# EAGLE design beacon (EAGLE 8.1.1)
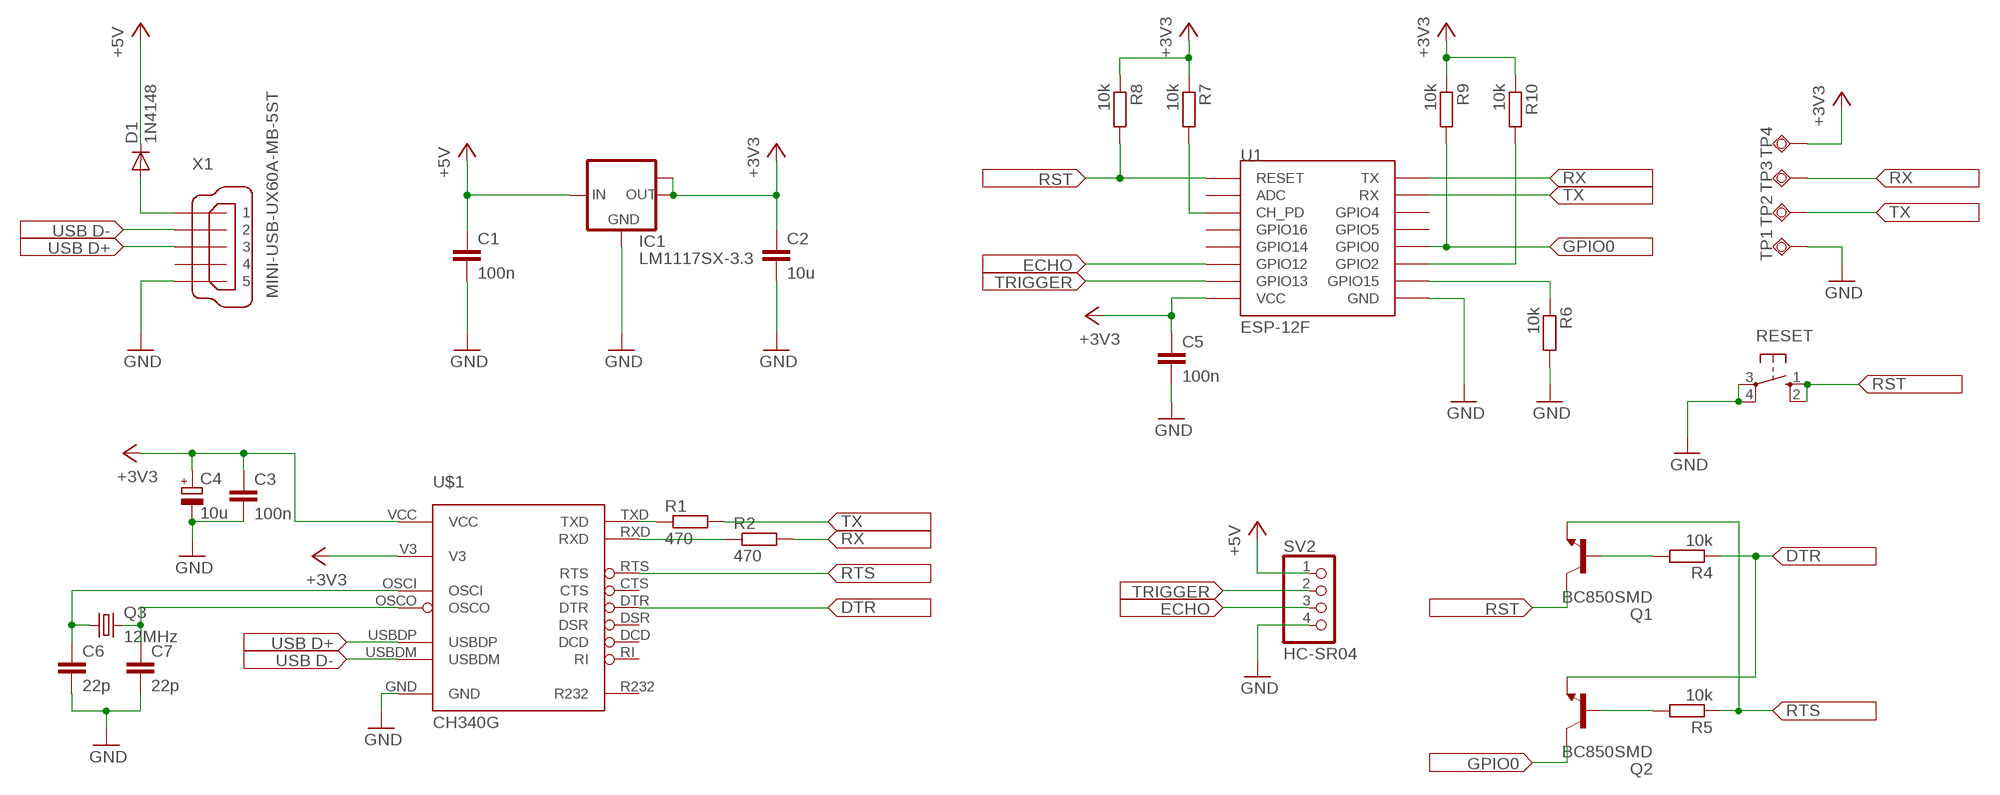
[diagram p0: schematic, sheet 1]

## Parts
C1  100n  C-EUC1206K  [C1206K]
C2  10u  C-EUC1206K  [C1206K]
C3  100n  C-EUC1206K  [C1206K]
C4  10u  CPOL-EU175TMP-0810  [175TMP-0810]
C5  100n  C-EUC1206K  [C1206K]
C6  22p  C-EUC1206K  [C1206K]
C7  22p  C-EUC1206K  [C1206K]
D1  1N4148  S1M  [SMA]
IC1  LM1117SX-3.3  [TO263]
Q1  BC850SMD  [SOT23-BEC]
Q2  BC850SMD  [SOT23-BEC]
Q3  12MHz  CRYSTALSM49  [SM49]
R1  470  R-EU_R1206  [R1206]
R2  470  R-EU_R1206  [R1206]
R4  10k  R-EU_R1206  [R1206]
R5  10k  R-EU_R1206  [R1206]
R6  10k  R-EU_R1206  [R1206]
R7  10k  R-EU_R1206  [R1206]
R8  10k  R-EU_R1206  [R1206]
R9  10k  R-EU_R1206  [R1206]
R10  10k  R-EU_R1206  [R1206]
RESET  10-XX  [B3F-10XX]
SV2  HC-SR04  PINHD-1X4/90  [1X04/90]
TP1  TPSQTP20SQ  [TP20SQ]
TP2  TPSQTP20SQ  [TP20SQ]
TP3  TPSQTP20SQ  [TP20SQ]
TP4  TPSQTP20SQ  [TP20SQ]
U1  ESP-12F  ESP12SMD  [ESP12-SMD]
U$1  CH340G  [SOP16]
X1  MINI-USB-UX60A-MB-5ST  [UX60A-MB-5ST]

## Nets
+3V3: C2.1 C3.1 C4.+ C5.1 IC1.2(OUT) IC1.TAB(OUT1) R7.1 R8.1 R9.1 R10.1 TP4.TP U1.VCC U$1.V3 U$1.VCC
+5V: C1.1 D1.C IC1.3(IN) SV2.1
DTR: Q2.E R4.1 U$1.DTR
ECHO: SV2.3 U1.GPIO12
GND: C1.2 C2.2 C3.2 C4.- C5.2 C6.2 C7.2 IC1.1(GND) R6.2 RESET.3(P) RESET.4(P1) SV2.4 TP1.TP U1.GND U$1.GND X1.5
GPIO0: Q2.C R9.2 U1.GPIO0
N$1: R1.1 U$1.TXD
N$2: R2.1 U$1.RXD
N$3: C6.1 Q3.1 U$1.OSCI
N$4: C7.1 Q3.2 U$1.OSCO
N$5: D1.A X1.1
N$6: R6.1 U1.GPIO15
N$8: R7.2 U1.CH_PD
N$9: Q1.B R4.2
N$11: Q2.B R5.2
N$12: R10.2 U1.GPIO2
RST: Q1.C R8.2 RESET.1(S) RESET.2(S1) U1.RESET
RTS: Q1.E R5.1 U$1.RTS
RX: R2.2 TP3.TP U1.TXD0(TX)
TRIGGER: SV2.2 U1.GPIO13
TX: R1.2 TP2.TP U1.RXD0(RX)
USBDM: U$1.USBDM X1.2
USBDP: U$1.USBDP X1.3
Unconnected: U1.ADC U1.GPIO4 U1.GPIO5 U1.GPIO14 U1.GPIO16 U$1.CTS U$1.DCD U$1.DSR U$1.R232 U$1.RI X1.4

## Library data of the parts
C1-C3 C5-C7 = rcl:C-EU: CAPACITOR, European symbol
C4 = rcl:CPOL-EU: POLARIZED CAPACITOR, European symbol
D1 = diode:S1M
IC1 = lm1117:LM1117SX-*
Q1 Q2 = transistor-npn:BC850*: NPN Transistor
Q3 = crystal:CRYSTAL: CRYSTAL; OC_FARNELL: unknown; OC_NEWARK: unknown
R1 R2 R4-R10 = rcl:R-EU_: RESISTOR, European symbol
RESET = switch-omron:10-XX: OMRON SWITCH; MPN: B3F-1000; OC_FARNELL: 176432; OC_NEWARK: 36M3542
SV2 = pinhead:PINHD-1X4: PIN HEADER
TP1-TP4 = testpad:TPSQ: Test pad
U1 = esp8266modules:ESP12: ESP8266 Wifi module 12
U$1 = ch340g:CH340G
X1 = con-hirose:MINI-USB-: MINI USB Connector Source: http://www.hirose.co.jp/cataloge_hp/e24000019.pdf; OC_FARNELL: unknown; OC_NEWARK: unknown

## Board
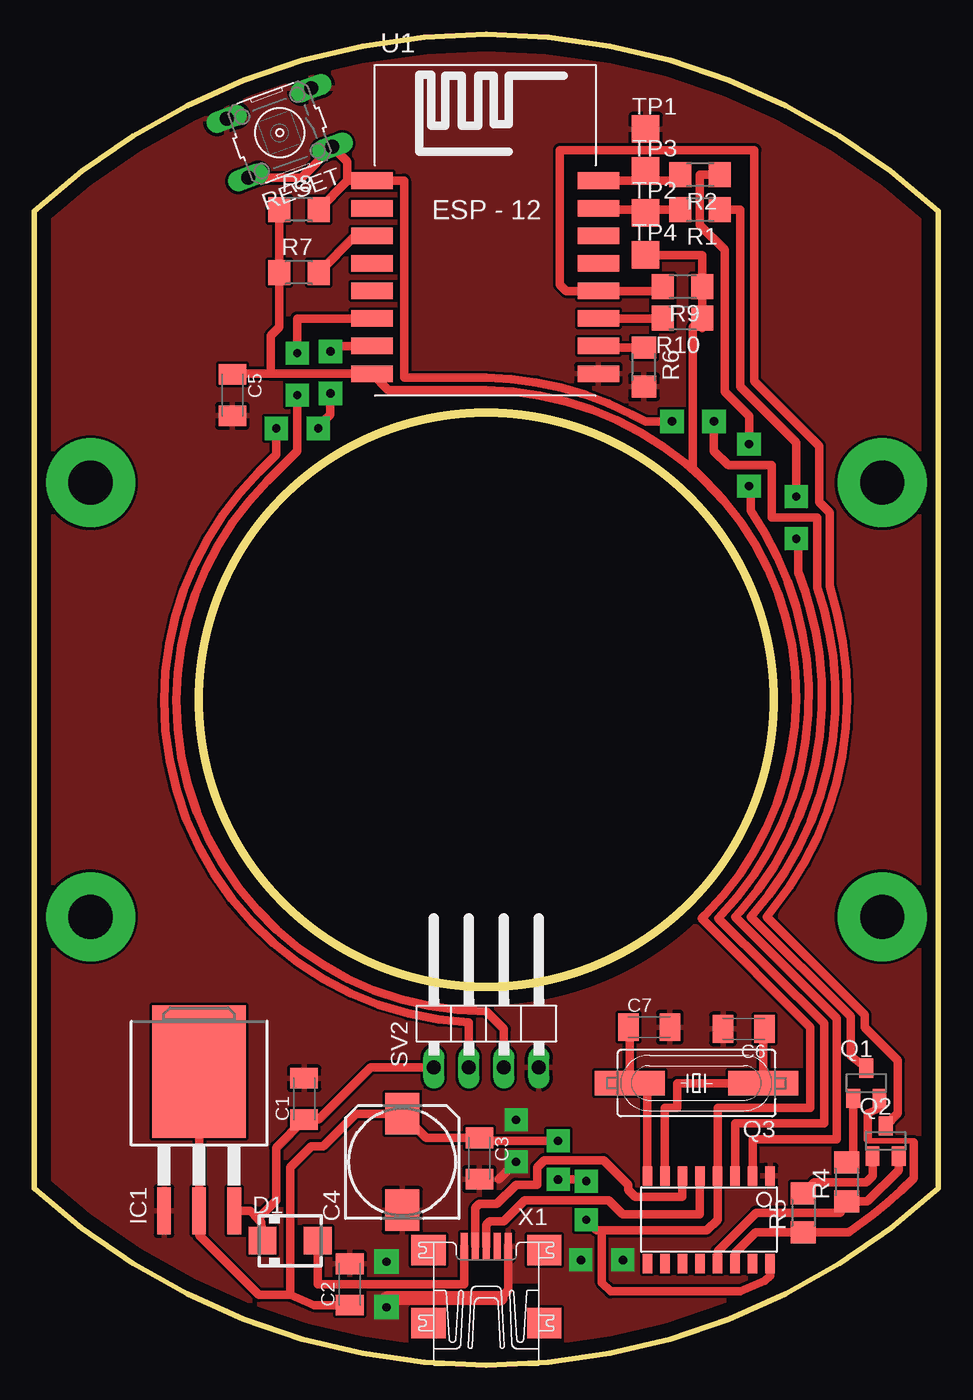
[diagram p1: board, top side]
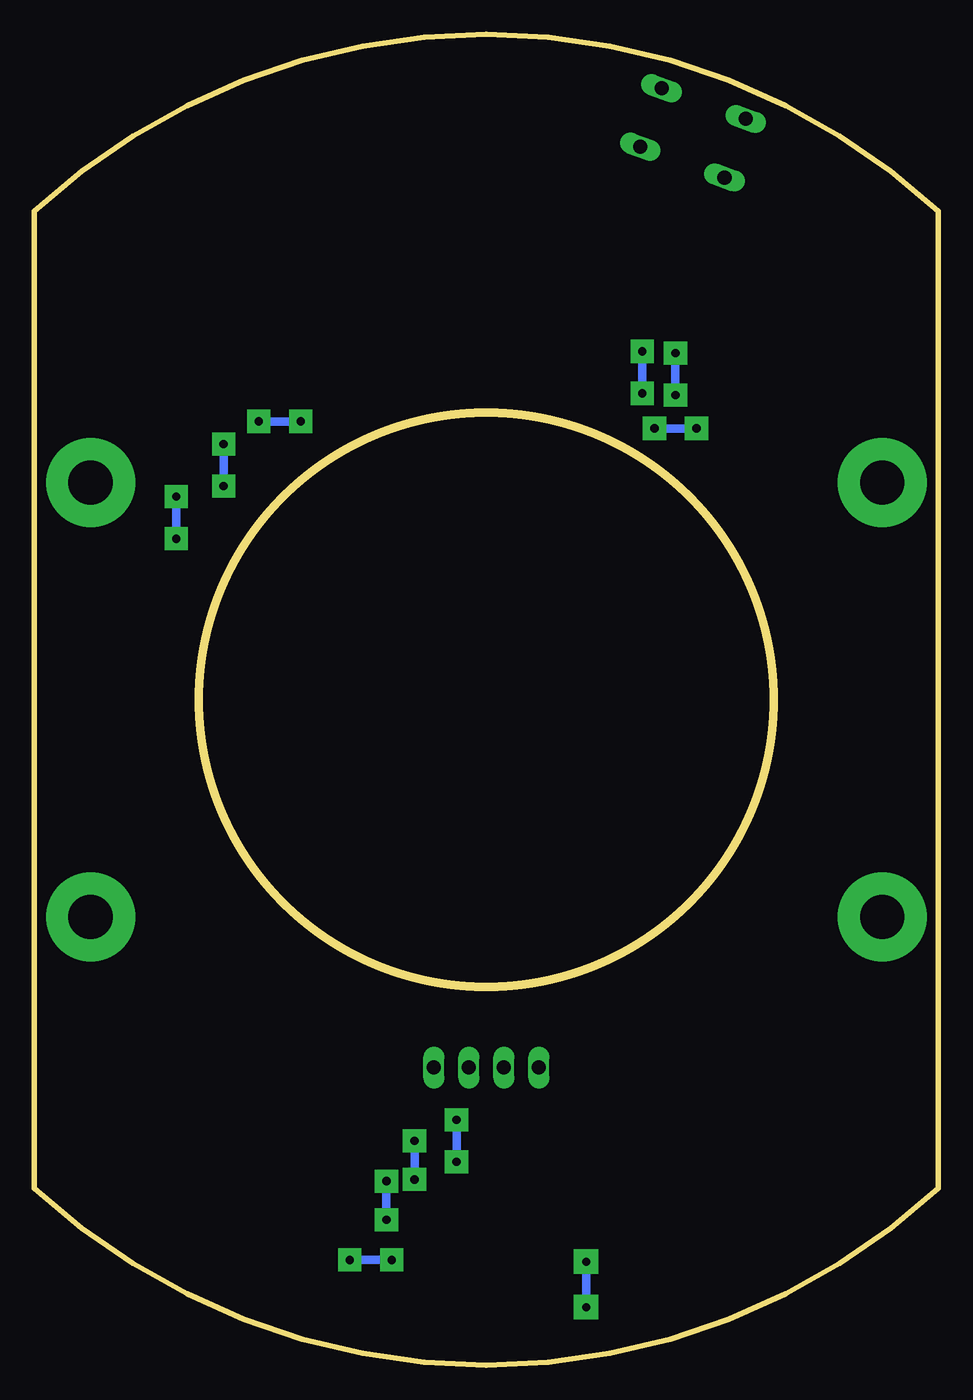
[diagram p2: board, bottom side, seen from below]

Size 65.53 x 96.52 mm. Coordinates in mm from the lower left corner, seen from the top.
Outline: 65.53,12.83 65.53,83.69 arc86 0,83.69 0,12.83 arc86 65.53,12.83
Outline: circle at 32.77,48.26 radius 20.83
Copper layers (1*16): Top 0.035mm / dielectric 1.5mm / Bottom 0.035mm
Design rules "default": minimum track width 10mil, minimum drill 24mil, track to track 8mil, track to pad 8mil, pad to pad 8mil, via to via 8mil, smd to smd 8mil, copper to edge 40mil, drill to drill 8mil, minimum pad ring 10mil, minimum via ring 8mil, stop-mask expansion 4mil, vias tented up to drill 0mil, thermal gap 10mil

### Footprints (pad centres in the part's own frame; a part is rotated, then mirrored left to right if it is on the bottom)
C1206K = smd 1.5 x 2: 1 -1.5,0; 2 1.5,0
175TMP-0810 = smd 3 x 2.5: + 3.5,0; - -3.5,0
SMA = smd 2 x 2: A 2,0; C -2,0
TO263 = smd 1 x 3.4: 1 -2.54,-6.6; 2 0,-6.6; 3 2.54,-6.6 | smd 6.8 x 9.6: TAB 0,3.5
SOT23-BEC = smd 1 x 1.4: B -0.95,-1.1; C 0,1.1; E 0.95,-1.1
SM49 = smd 5.08 x 1.778: 1 -4.826,0; 2 4.826,0
R1206 = smd 1.6 x 1.803: 1 -1.422,0; 2 1.422,0
B3F-10XX = drill 1.016 long: 1 -3.251,2.261; 2 3.251,2.261; 3 -3.251,-2.261; 4 3.251,-2.261
1X04/90 = drill 1.016 long: 1 -3.81,-3.81; 2 -1.27,-3.81; 3 1.27,-3.81; 4 3.81,-3.81
TP20SQ = smd 2 x 2: TP 0,0
ESP12-SMD = smd 3 x 1.2: ADC -8.3,3.8; CH_PD -8.3,1.8; GND 8.1,-8.2; GPIO0 8.1,-2.2; GPIO2 8.1,-4.2; GPIO4 8.1,1.8; GPIO5 8.1,-0.2; GPIO12 -8.3,-4.2; GPIO13 -8.3,-6.2; GPIO14 -8.3,-2.2; GPIO15 8.1,-6.2; GPIO16 -8.3,-0.2; RESET -8.3,5.8; RXD0 8.1,3.8; TXD0 8.1,5.8; VCC -8.3,-8.2
SOP16 = smd 1.422 x 0.711: CTS 3.175,-4.445; DCD 3.175,-0.635; DSR 3.175,-3.175; DTR 3.175,0.635; GND -3.175,4.445; OSCI -3.175,-3.175; OSCO -3.175,-4.445; R232 3.175,3.175; RI 3.175,-1.905; RTS 3.175,1.905; RXD -3.175,1.905; TXD -3.175,3.175; USBDM -3.175,-1.905; USBDP -3.175,-0.635; V3 -3.175,0.635; VCC 3.175,4.445
UX60A-MB-5ST = smd 2 x 0.5: 1 2.25,1.6; 2 2.25,0.8; 3 2.25,0; 4 2.25,-0.8; 5 2.25,-1.6 | smd 2.2 x 2.5: M1 -3.3,-4.2; M2 -3.3,4.2; M3 2,4.2; M4 2,-4.2

### Placement (x,y rotation side)
C1  19.56,19.3 90 top
C2  22.86,5.84 90 top
C3  32.26,14.99 270 top
C4  26.67,14.73 90 top
C5  14.35,70.36 270 top
C6  51.44,24.38 180 top
C7  44.58,24.51 0 top
D1  18.54,9.02 0 top
IC1  11.94,17.78 0 top
Q1  60.33,20.45 0 top
Q2  61.72,16.26 0 top
Q3  48.01,20.45 180 top
R1  48.26,83.82 180 top
R2  48.26,86.36 180 top
R4  58.9,13.29 90 top
R5  55.75,11.05 90 top
R6  44.2,72.39 270 top
R7  19.18,79.25 0 top
R8  19.18,83.82 0 top
R9  46.99,78.23 180 top
R10  46.99,75.95 180 top
RESET  17.78,89.39 200 top
SV2  32.77,25.4 0 top
TP1  44.32,89.66 0 top
TP2  44.32,83.57 0 top
TP3  44.32,86.61 0 top
TP4  44.32,80.52 0 top
U1  32.79,80.12 0 top
U$1  48.89,10.54 270 top
X1  32.77,6.35 90 top

### Tracks (layer width: path | path; a pad name or v marks a point on that pad's centre or on a via)
+3V3  (via drill 0.6 pad 1.68)
  Top 0.61: IC1.TAB IC1.2 11.94,9.4 16.26,5.08 18.54,5.08 | 18.54,5.08 20.3,4.34 C2.1 | v40,13.34 39.88,13.46 v37.97,13.46 | v37.97,16.26 32.49,16.26 C3.1 28.42,16.49 C4.+ 23.31,18.23 20.95,15.88 20.07,15.88 18.54,14.35 18.54,5.08 | v40,10.54 40.77,9.78 41.15,9.78 | U$1.VCC 53.34,6.48 52.96,6.1 51.18,5.33 41.78,5.33 41.15,5.97 41.15,9.78 | 41.15,9.78 48.77,9.78 49.53,10.54 U$1.V3 49.53,18.67 56.26,18.67 56.26,24.51 48.39,32.39 48.64,32.64 arc44 55.24,48.26 arc47 48.64,64.14 | 48.64,64.14 arc43 32.77,70.74 25.66,70.74 U1.VCC 17.14,71.92 | 17.14,71.92 14.35,71.92 C5.1 | 17.14,71.92 17.14,74.68 17.75,75.29 R7.1 R8.1 | 48.41,75.21 R10.1 | R10.1 R9.1 48.41,80.52 TP4.TP | R10.1 47.75,75.29 47.75,65.02 48.64,64.14
  Bottom 0.61: v40,10.54 v40,13.34 | v37.97,13.46 v37.97,16.26
+5V
  Top 0.61: SV2.1 24.38,21.59 20.6,17.8 C1.1 17.53,15.77 17.53,11.94 16.21,10.62 | D1.C 16.46,10.37 16.21,10.62 | 16.21,10.62 15.65,11.18 IC1.3
DTR
  Top 0.61: U$1.DTR 49.53,8.26 52.32,11.05 58.44,11.05 R4.1 60.4,11.86 62.67,14.13 Q2.E
ECHO  (via drill 0.6 pad 1.68)
  Top 0.61: SV2.3 34.04,24.38 32.77,25.65 arc-90 10.29,48.26 arc-45 16.89,64.14 19.05,66.29 v19.05,70.36 | U1.GPIO12 19.05,75.92 v19.05,73.41
  Bottom 0.61: v19.05,73.41 v19.05,70.36
GND  (via drill 0.6 pad 1.68, 0.6 pad 1.78)
  Top 0.61: X1.5 34.37,5.41 33.78,4.83 | v34.92,14.73 33.68,13.49
  Top 1.016: 33.78,4.83 25.53,4.83
  Bottom 0.61: v25.53,4.19 v25.53,7.49 | v34.92,17.78 v34.92,14.73 | v42.67,7.62 v39.62,7.62
  pour Top: 32.77,95.25 arc-90 79.76,48.26 arc-90 32.77,1.27 arc-90 -14.22,48.26 arc-90
GPIO0
  Top 0.61: Q2.C 62.61,18.25 62.61,22.1 60.2,24.51 60.2,25.4 53.09,32.51 53.52,33.05 arc39 58.93,48.26 arc18 57.66,56.52 57.66,61.85 56.9,62.61 56.9,66.68 52.2,71.37 52.2,88.14 38.1,88.14 38.1,78.36 38.54,77.92 U1.GPIO0 45.57,77.92 R9.2
N$1  (via drill 0.6 pad 1.68)
  Top 0.61: U$1.TXD 52.07,16.38 58.17,16.38 58.17,25.15 50.8,32.51 51.18,32.89 arc50 56.9,51.69 arc13 55.37,57.53 55.37,59.82 v55.24,59.94 | v55.24,62.99 55.24,66.93 51.18,70.99 51.18,83.82 R1.1
  Bottom 0.61: v55.24,59.94 v55.24,62.99
N$2  (via drill 0.6 pad 1.68)
  Top 0.61: U$1.RXD 50.8,17.53 57.28,17.53 57.28,24.77 49.58,32.41 arc47 56.13,49.28 arc32 51.94,61.98 51.94,63.63 v51.82,63.75 | v51.82,66.8 51.82,68.83 50.04,70.61 50.04,80.9 48.26,82.68 48.26,86.34 R2.1
  Bottom 0.61: v51.82,63.75 v51.82,66.8
N$3
  Top 0.61: C6.1 52.83,24.28 Q3.1 46.61,20.45 46.61,18.67 45.72,18.67 U$1.OSCI
N$4
  Top 0.61: C7.1 43.18,24.41 Q3.2 44.45,20.45 U$1.OSCO
N$5
  Top 0.61: X1.1 31.17,5.84 20.54,5.84 D1.A
N$6
  Top 0.61: U1.GPIO15 40.99,73.81 R6.1
N$7  (via drill 3.2 pad 6.45)
  other vias: 61.47,64.01
N$8
  Top 0.61: R7.2 23.27,81.92 U1.CH_PD
N$9
  Top 0.61: Q1.B 59.38,14.8 R4.2
N$10  (via drill 3.2 pad 6.45)
  other vias: 61.47,32.51
N$11
  Top 0.61: 56.11,12.83 R5.2 56.54,13.26 60.3,13.26 60.77,13.73 Q2.B
N$12
  Top 0.61: U1.GPIO2 45.57,75.92 R10.2
N$13  (via drill 3.2 pad 6.45)
  other vias: 4.06,32.51
N$14  (via drill 3.2 pad 6.45)
  other vias: 4.06,64.01
RST  (via drill 0.6 pad 1.68)
  Top 0.61: Q1.C 59.18,22.44 59.18,25.27 51.94,32.51 arc49 57.91,51.44 arc12 56.77,56.39 56.77,61.47 53.47,61.47 53.47,65.28 50.29,65.28 49.28,66.29 v49.28,68.45 | 22.69,85.92 R8.2 | 22.69,85.92 U1.RESET 26.8,85.92 26.8,71.63 32.77,71.63 arc-26 43.31,68.96 44.32,68.45 v46.23,68.45 | 22.69,85.92 22.69,87.28 RESET.1 19.38,86.15 RESET.2
  Bottom 0.61: v46.23,68.45 v49.28,68.45
RTS
  Top 0.406: 63.75,16.15 63.75,16.26 60.43,16.26 60.43,16.38
  Top 0.61: U$1.RTS 50.8,8.13 52.3,9.63 R5.1 59.03,9.63 | 59.03,9.63 59.05,9.65 | 59.03,9.63 60.83,10.92 arc6 63.75,13.54 63.75,16.15 | Q1.E 61.27,18.6 60.43,18.26 60.43,16.38
RX
  Top 0.61: R2.2 46.2,85.92 45.02,85.92 | 45.02,85.92 U1.TXD0 | TP3.TP 45.02,85.92
TRIGGER  (via drill 0.6 pad 1.68)
  Top 0.61: SV2.2 31.5,24.84 arc-87 9.4,48.26 arc-44 16.26,64.77 17.53,66.04 v17.53,67.95 | U1.GPIO13 21.46,73.92 v21.46,73.53 | v21.46,70.49 21.46,68.96 20.57,68.07 v20.57,67.95
  Bottom 0.61: v21.46,73.53 v21.46,70.49 | v20.57,67.95 v17.53,67.95
TX
  Top 0.61: U1.RXD0 40.89,83.82 R1.2 44.32,83.82 TP2.TP
USBDM
  Top 0.61: X1.2 31.97,11.39 32.26,11.68 33.53,11.68 34.92,13.08 36.45,13.08 36.45,14.35 36.96,14.86 41.27,14.86 43.05,13.08 43.05,12.7 43.56,12.19 46.99,12.19 U$1.USBDM
USBDP
  Top 0.61: X1.3 32.77,10.16 33.02,10.41 34.04,10.41 35.56,11.94 41.66,11.94 42.67,10.92 48.26,10.92 U$1.USBDP